# Altium schematic sheet Twintig-IMUs.SchDoc
size A4; SheetNumber: 1; SheetTotal: 1
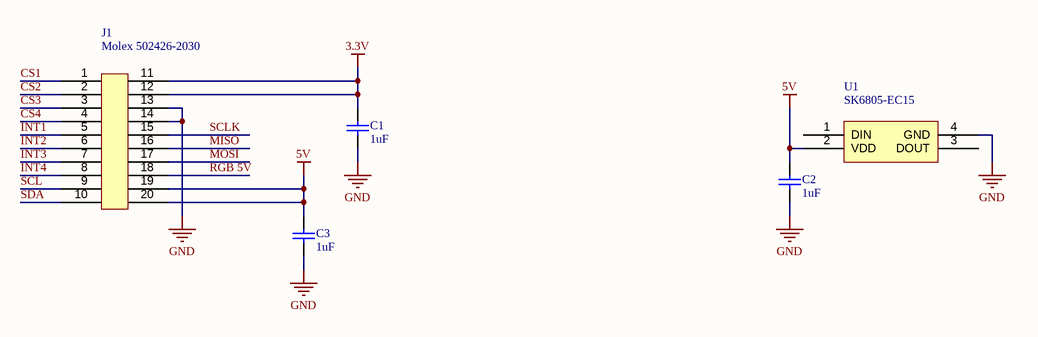
[diagram p0: Twintig-IMUs.SchDoc]

## Parts
C1  1uF  [Capacitor 0402]
C2  1uF  [Capacitor 0402]
C3  1uF  [Capacitor 0402]
J1  Molex 502426-2030  [Molex 502426-2030]
U1  SK6805-EC15  [SK6805-EC15]

## Nets
3.3V: C1.2 J1.11 J1.12
5V: C2.2 C3.2 J1.19 J1.20 U1.2(VDD)
GND: C1.1 C2.1 C3.1 J1.13 J1.14 U1.4(GND)
CS1: J1.1
CS2: J1.2
CS3: J1.3
CS4: J1.4
INT1: J1.5
INT2: J1.6
INT3: J1.7
INT4: J1.8
MISO: J1.16
MOSI: J1.17
RGB 5V: J1.18
SCL: J1.9
SCLK: J1.15
SDA: J1.10

Not connected (* = marked no-connect by the designer): U1 1(DIN) 3(DOUT)

## Notes on the sheet
- TITLE
- SIZE
- A4
- VARIANT
- PROJECT
- SHEET
- VERSION
- OF
- AUTHOR
- DATE

## Library data of the parts
C1-C3 = Capacitor